# Altium schematic sheet Power Supplies.SchDoc: EEG Measurement Circuit
size A3; Date: 24/01/2025; DrawnBy: Giang Phan Truong; SheetNumber: 2; SheetTotal: 7
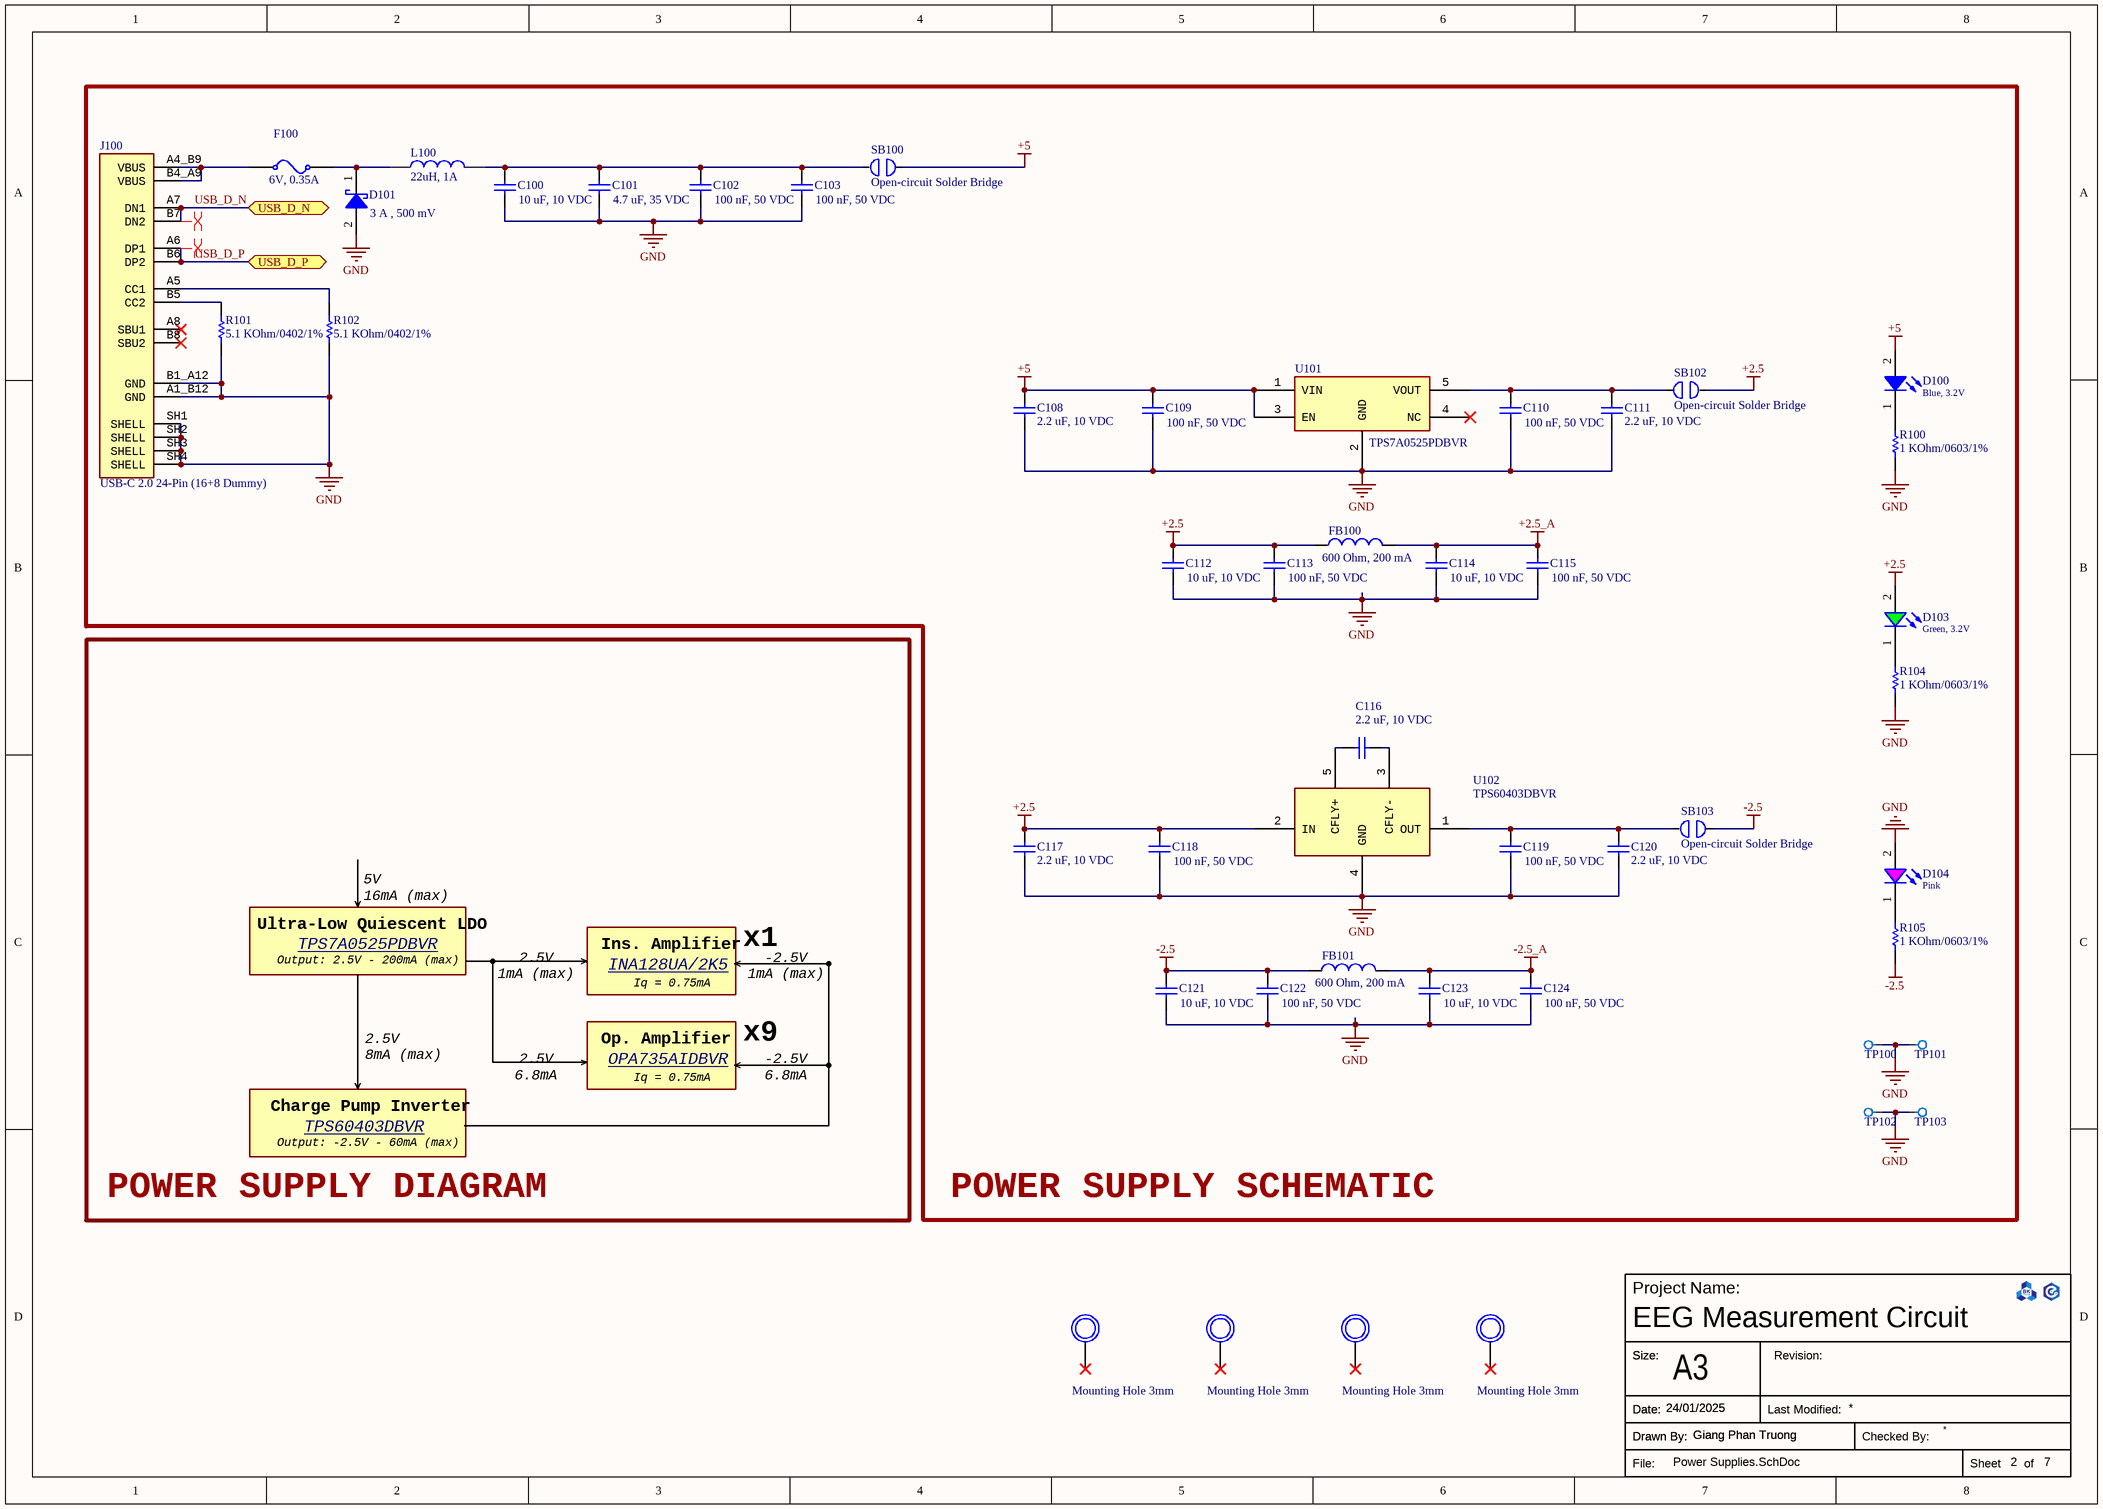
[diagram p0: Power Supplies.SchDoc]

## Parts
C100  10 uF, 10 VDC  [CAP_0603]
C101  4.7 uF, 35 VDC  [CAP_0603]
C102  100 nF, 50 VDC  [CAP_0603]
C103  100 nF, 50 VDC  [CAP_0603]
C108  2.2 uF, 10 VDC  [CAP_0603]
C109  100 nF, 50 VDC  [CAP_0603]
C110  100 nF, 50 VDC  [CAP_0603]
C111  2.2 uF, 10 VDC  [CAP_0603]
C112  10 uF, 10 VDC  [CAP_0603]
C113  100 nF, 50 VDC  [CAP_0603]
C114  10 uF, 10 VDC  [CAP_0603]
C115  100 nF, 50 VDC  [CAP_0603]
C116  2.2 uF, 10 VDC  [CAP_0603]
C117  2.2 uF, 10 VDC  [CAP_0603]
C118  100 nF, 50 VDC  [CAP_0603]
C119  100 nF, 50 VDC  [CAP_0603]
C120  2.2 uF, 10 VDC  [CAP_0603]
C121  10 uF, 10 VDC  [CAP_0603]
C122  100 nF, 50 VDC  [CAP_0603]
C123  10 uF, 10 VDC  [CAP_0603]
C124  100 nF, 50 VDC  [CAP_0603]
D100  Blue, 3.2V  [WL-SMCW_0603_H=0.7mm]
D101  3 A , 500 mV  [SMC (DO-214AB)]
D103  Green, 3.2V  [WL-SMCW_0603_H=0.7mm]
D104  Pink  [WL-SMCW_0603_H=0.7mm]
F100  6V, 0.35A  [Fuse_SMD_1206]
FB100  600 Ohm, 200 mA  [FER_0603]
FB101  600 Ohm, 200 mA  [FER_0603]
H100  Mounting Hole 3mm  [3mm with via]
H101  Mounting Hole 3mm  [3mm with via]
H102  Mounting Hole 3mm  [3mm with via]
H103  Mounting Hole 3mm  [3mm with via]
J100  value USB-C 2.0 24-Pin (16+8 Dummy)  [GCT_USB4105-GF-A]  (hidden comment: USB4105-GF-A)
L100  22uH, 1A  [Inductor_CDRH4D28]
R100  value 1 KOhm/0603/1%  [R0603]  (hidden comment: Resistor 1 KOhm 0603 1%)
R101  value 5.1 KOhm/0402/1%  [R0402]  (hidden comment: Resistor 5.1 KOhm 0402)
R102  value 5.1 KOhm/0402/1%  [R0402]  (hidden comment: Resistor 5.1 KOhm 0402)
R104  value 1 KOhm/0603/1%  [R0603]  (hidden comment: Resistor 1 KOhm 0603 1%)
R105  value 1 KOhm/0603/1%  [R0603]  (hidden comment: Resistor 1 KOhm 0603 1%)
SB100  Open-circuit Solder Bridge  [SolderBridgeOpen]
SB102  Open-circuit Solder Bridge  [SolderBridgeOpen]
SB103  Open-circuit Solder Bridge  [SolderBridgeOpen]
TP100  Testpoint_SMD  [TestPoint_Pad_3.0x3.0mm]  (value not drawn)
TP101  Testpoint_SMD  [TestPoint_Pad_3.0x3.0mm]  (value not drawn)
TP102  Testpoint_SMD  [TestPoint_Pad_3.0x3.0mm]  (value not drawn)
TP103  Testpoint_SMD  [TestPoint_Pad_3.0x3.0mm]  (value not drawn)
U101  TPS7A0525PDBVR  [DBV0005A_L]
U102  TPS60403DBVR  [SOT95P280X145-5N]

## Blocks framed on the sheet
POWER SUPPLY SCHEMATIC: C100-C103 C108-C124 D100 D101 D103 D104 F100 FB100 FB101 J100 L100 R100-R102 R104 R105 SB100 SB102 SB103 TP100-TP103 U101 U102

## Ports
USB_D_N (bidir, see Block Diagram[7B], Interface[5B]), USB_D_P (bidir, see Block Diagram[7B], Interface[5B])

## Nets
+2.5: C112.2 C113.2 C117.2 C118.2 D103.2(A) FB100.1 SB102.1 U102.2(IN)
+2.5_A: C114.2 C115.2 FB100.2
+5: C108.2 C109.2 D100.2(A) SB100.1 U101.1(VIN) U101.3(EN)
-2.5: C121.2 C122.2 FB101.1 R105.2 SB103.1
-2.5_A: C123.2 C124.2 FB101.2
GND: C100.1 C101.1 C102.1 C103.1 C108.1 C109.1 C110.1 C111.1 C112.1 C113.1 C114.1 C115.1 C117.1 C118.1 C119.1 C120.1 C121.1 C122.1 C123.1 C124.1 D101.2(A) D104.2(A) J100.A1_B12(GND) J100.B1_A12(GND) J100.SH1(SHELL) J100.SH2(SHELL) J100.SH3(SHELL) J100.SH4(SHELL) R100.2 R101.1 R102.1 R104.2 TP100.1 TP101.1 TP102.1 TP103.1 U101.2(GND) U102.4(GND)
USB_D_N: J100.A7(DN1) J100.B7(DN2) ; port USB_D_N
USB_D_P: J100.A6(DP1) J100.B6(DP2) ; port USB_D_P
NetC100_2: C100.2 C101.2 C102.2 C103.2 L100.2 SB100.2
NetC110_2: C110.2 C111.2 SB102.2 U101.5(VOUT)
NetC116_1: C116.1 U102.3(CFLY-)
NetC116_2: C116.2 U102.5(CFLY+)
NetC119_2: C119.2 C120.2 SB103.2 U102.1(OUT)
NetD100_1: D100.1(K) R100.1
NetD101_1: D101.1(K) F100.1 L100.1
NetD103_1: D103.1(K) R104.1
NetD104_1: D104.1(K) R105.1
NetF100_0: F100.0 J100.A4_B9(VBUS) J100.B4_A9(VBUS)
NetJ100_A5: J100.A5(CC1) R102.2
NetJ100_B5: J100.B5(CC2) R101.2

Not connected (* = marked no-connect by the designer): H100 0; H101 0; H102 0; H103 0; J100 A8(SBU1)* B8(SBU2)*; U101 4(NC)*

## Layout directives
differential pair: USB_D_N, USB_D_P

## Notes on the sheet
- 5V
  16mA (max)
- Ultra-Low Quiescent LDO
- Output: 2.5V - 200mA (max)
- TPS7A0525PDBVR <https://www.digikey.com/en/products/detail/texas-instruments/TPS7A0525PDBVR/9489224>
- 2.5V
  1mA (max)
- Ins. Amplifier
- INA128UA/2K5 <https://www.digikey.com/en/products/detail/texas-instruments/INA128UA-2K5/300998>
- Iq = 0.75mA
- x1
- -2.5V
  1mA (max)
- 2.5V
  8mA (max)
- Op. Amplifier
- x9
- Charge Pump Inverter
- 2.5V
  6.8mA (max)
- OPA735AIDBVR <https://www.digikey.com/en/products/detail/texas-instruments/OPA735AIDBVR/1572946>
- -2.5V
  6.8mA (max)
- Output: -2.5V - 60mA (max)
- TPS60403DBVR <https://www.digikey.com/en/products/detail/texas-instruments/TPS60403DBVR/1672064>
- POWER SUPPLY DIAGRAM
- Project Name:
- Size
- Size:
- A3
- Revision:
- Drawn By:
- Date:
- File:
- Last Modified:
- Checked By:
- Sheet
- of

## Library data of the parts
C100 C112 C114 C121 C123 = 0106031061010: CAP, size 0603, 10 uF, 10 VDC; Manufacture Name: Samsung Electro-Mechanics; Manufacture SN: CL10A106KP8NNWC; Capacitance: 10 uF; Tolerance: +/-10%; Voltage Rating DC: 10 VDC; ComponentLink2Description: Datasheet; ComponentLink2URL: https://www.mouser.vn/datasheet/2/585/MLCC-1837944.pdf; Operating Temperature: -55 to +125degC; Packaging: Tape and Reel; Mounting Technology: SMT; Size: 0603; Supplier 1 Name: Mouser; Supplier 1 SN: 187-CL10A106KP8NNWC; Supplier 1 URL: https://www.mouser.vn/ProductDetail/Samsung-Electro-Mechanics/CL10A106KP8NNWC?qs=xZ%2FP%252Ba9zWqZx8LSX23YqWA%3D%3D&utm_source=mouser-refine-download&utm_medium=file&utm_campaign=CL10A106KP8NNWC&utm_content=Samsung-Electro-Mechanics; Supplier 2 Name: Digi-Key; Supplier 2 SN: 1276-CL10A106KP8NNWCTR-ND; Supplier 2 URL: https://www.digikey.com/en/products/detail/samsung-electro-mechanics/cl10a106kp8nnwc/16572907; Supplier 3 Name: thegioiic; Supplier 3 SN: N/A; Supplier 3 URL: https://www.thegioiic.com/tu-gom-0603-10uf-25v; Value: 10 uF, 10 VDC; Buy: http://tme.vn/Product.aspx?id=1165#page=pro_info
C101 = 0106034751035: CAP, size 0603, 4.7 uF, 35 VDC; Manufacture Name: Samsung Electro-Mechanics; Manufacture SN: CL10A475KL8NRNC; Capacitance: 4.7 uF; Tolerance: +/-10%; Voltage Rating DC: 35 VDC; ComponentLink2Description: Datasheet; ComponentLink2URL: https://www.mouser.vn/datasheet/2/585/MLCC-1837944.pdf; Operating Temperature: -55 to +125degC; Packaging: Tape and Reel; Mounting Technology: SMT; Size: 0603; Supplier 1 Name: Mouser; Supplier 1 SN: 187-CL10A475KL8NRNC; Supplier 1 URL: https://www.mouser.vn/ProductDetail/Samsung-Electro-Mechanics/CL10A475KL8NRNC?qs=xZ%2FP%252Ba9zWqa0jfvJtp%252BUEg%3D%3D&utm_source=mouser-refine-download&utm_medium=file&utm_campaign=CL10A475KL8NRNC&utm_content=Samsung-Electro-Mechanics; Supplier 2 Name: Digi-Key; Supplier 2 SN: 1276-6794-2-ND; Supplier 2 URL: https://www.digikey.com/en/products/detail/samsung-electro-mechanics/cl10a475kl8nrnc/5961278; Supplier 3 Name: thegioiic; Supplier 3 SN: N/A; Supplier 3 URL: N/A; Value: 4.7 uF, 35 VDC; ComponentLink3Description: Buy; ComponentLink3URL: http://www.tme.vn/Product.aspx?id=1163#page=pro_info
C102 C103 C109 C110 C113 C115 C118 C119 C122 C124 = 0106031041050: CAP, size 0603, 100 nF, 50 VDC; Manufacture Name: TDK; Manufacture SN: CGA3E3X8R1H104K080AE; Capacitance: 100 nF; Tolerance: +/-10%; Voltage Rating DC: 50 VDC; ComponentLink2Description: Datasheet; ComponentLink2URL: https://product.tdk.com/system/files/dam/doc/product/capacitor/ceramic/mlcc/catalog/mlcc_automotive_soft_en.pdf?ref_disty=mouser; Operating Temperature: -55 to +125degC; Packaging: Tape and Reel; Mounting Technology: SMT; Size: 0603; Supplier 1 Name: Mouser; Supplier 1 SN: 810-CGA3E3X8R1H104KA; Supplier 1 URL: https://www.mouser.com/ProductDetail/TDK/CGA3E3X8R1H104K080AE?qs=nQSIdc08i%252Bd8g3IRRgU2bw%3D%3D&utm_source=mouser-refine-download&utm_medium=file&utm_campaign=CGA3E3X8R1H104K080AE&utm_content=TDK; Supplier 2 Name: Digi-Key; Supplier 2 SN: 445-173697-2-ND; Supplier 2 URL: https://www.digikey.com/en/products/detail/tdk-corporation/cga3e3x8r1h104k080ae/5809262; Supplier 3 Name: thegioiic; Supplier 3 SN: N/A; Supplier 3 URL: N/A; Value: 100 nF, 50 VDC
  C102 C103: ComponentLink3Description: Buy; ComponentLink3URL: http://www.tme.vn/Product.aspx?id=739#page=pro_info
C108 C111 C116 C117 C120 = 0106032251010: CAP, size 0603, 2.2 uF, 10 VDC; Manufacture Name: Samsung Electro-Mechanics; Manufacture SN: CL10A225KP8NNWC; Capacitance: 2.2 uF; Tolerance: +/-10%; Voltage Rating DC: 10 VDC; ComponentLink2Description: Datasheet; ComponentLink2URL: https://www.mouser.vn/datasheet/2/585/Samsung_MLCC_1837944-1929650.pdf; Operating Temperature: -55 to +125degC; Packaging: Tape and Reel; Mounting Technology: SMT; Size: 0603; Supplier 1 Name: Mouser; Supplier 1 SN: 187-CL10A225KP8NNWC; Supplier 1 URL: https://www.mouser.vn/ProductDetail/Samsung-Electro-Mechanics/CL10A225KP8NNWC?qs=f6khj2Jg0Fj5oIVDjMV6rg%3D%3D&utm_source=mouser-refine-download&utm_medium=file&utm_campaign=CL10A225KP8NNWC&utm_content=Samsung-Electro-Mechanics; Supplier 2 Name: Digi-Key; Supplier 2 SN: 1276-CL10A225KP8NNWCTR-ND; Supplier 2 URL: https://www.digikey.com/en/products/detail/samsung-electro-mechanics/cl10a225kp8nnwc/16572766; Supplier 3 Name: thegioiic; Supplier 3 SN: N/A; Supplier 3 URL: N/A; Value: 2.2 uF, 10 VDC
D100 = 160603BlueBlur: WL-SMCW SMT Mono-color Chip LED Blur, size 0603, Blue, 3.2V, 140deg; Color: Blue; Size: 0603; Type: Blur; ComponentLink1Description: Datasheet link; ComponentLink1URL: N/A; ComponentLink2Description: Supplier 1 URL; ComponentLink2URL: https://www.mouser.vn/ProductDetail/ams-OSRAM/LB-Q39E-L2OO-35-1?qs=74fRo9GAWsz%2FeNvglIOl1w%3D%3D; ComponentLink3Description: Supplier 2 URL; ComponentLink3URL: https://www.digikey.com/en/products/detail/ams-osram-usa-inc/LB-Q39E-N1OO-35-1/2176321; ComponentLink4Description: Supplier 3 URL; ComponentLink4URL: N/A; Supplier 1 Name: Mouser; Supplier 1 SN: 720-LBQ39EL2N2351; Supplier 1 URL: https://www.mouser.vn/ProductDetail/ams-OSRAM/LB-Q39E-L2OO-35-1?qs=74fRo9GAWsz%2FeNvglIOl1w%3D%3D; Supplier 2 Name: Digi-Key; Supplier 2 SN: 475-LBQ39E-N1OO-35-1TR-ND; Supplier 2 URL: https://www.digikey.com/en/products/detail/ams-osram-usa-inc/LB-Q39E-N1OO-35-1/2176321; Supplier 3 Name: ICDayRoi; Supplier 3 SN: N/A; Supplier 3 URL: N/A; Value: Blue, 3.2V; ComponentLink5Description: Buy; ComponentLink5URL: https://www.thegioiic.com/led-xanh-duong-0603-dan-smd-trong-suot-harvatek
D101 = SS34: Schottky Diodes & Rectifiers 3.0 Amp 40 Volt; Manufacturer: Vishay Semiconductors; Manufacturer Part Number: SS34-E3/57T; Forward Current: 3 A; Forward Voltage: 500 mV; Max Surge Current: 100 A; Peak Reverse Voltage: 40 V; Reverse Current: 500 uA; Type: Schottky; Supplier 1 URL: https://www.mouser.vn/ProductDetail/Vishay-General-Semiconductor/SS34-E3-57T?qs=x2jpVgRnAtMC3f38kYWnRw%3D%3D; Supplier 2 URL: https://www.digikey.com/en/products/detail/vishay-general-semiconductor-diodes-division/ss34-e3-57t/1091554; Supplier 3 URL: https://www.thegioiic.com/ss34-sma-diode-schottky-3a; Value: 3 A , 500 mV; Maximum Diode Capacitance: N/A; Power Dissipation: N/A; Recovery Time: N/A; Supplier 1: Mouser; Supplier 1 Part Number: 625-SS34-E3; Supplier 2: Digi-Key; Supplier 2 Part Number: SS34-E3/57TGITR-ND; Supplier 3: thegioiic; Supplier 3 Part Number: SS34; Mount: SMD/SMT; Operating Temperature Max: + 85 C; Operating Temperature Min: - 40 C; Package / Case: SMC (DO-214AB); Packaging: Tape and Reel; ComponentLink1Description: Datasheet; ComponentLink1URL: https://www.vishay.com/doc?88751; LCSC Part #: C3008890
D103 = 160603GreenBlur: WL-SMCW SMT Mono-color Chip LED Blur, size 0603, Green, 3.2V, 140deg; Color: Green; Size: 0603; Type: Blur; ComponentLink1Description: Datasheet link; ComponentLink1URL: N/A; ComponentLink2Description: Supplier 1 URL; ComponentLink2URL: https://www.mouser.vn/ProductDetail/ROHM-Semiconductor/SMLD12EN1WT86?qs=qSfuJ%252Bfl%2Fd4fR%252B9yZydIwg%3D%3D; ComponentLink3Description: Supplier 2 URL; ComponentLink3URL: https://www.digikey.com/en/products/detail/rohm-semiconductor/SML-D12M8WT86/1641797; ComponentLink4Description: Supplier 3 URL; ComponentLink4URL: N/A; Supplier 1 Name: Mouser; Supplier 1 SN: 755-SMLD12EN1WT86; Supplier 1 URL: https://www.mouser.vn/ProductDetail/ROHM-Semiconductor/SMLD12EN1WT86?qs=qSfuJ%252Bfl%2Fd4fR%252B9yZydIwg%3D%3D; Supplier 2 Name: Digi-Key; Supplier 2 SN: 511-1578-2-ND; Supplier 2 URL: https://www.digikey.com/en/products/detail/rohm-semiconductor/SML-D12M8WT86/1641797; Supplier 3 Name: ICDayRoi; Supplier 3 SN: N/A; Supplier 3 URL: N/A; Value: Green, 3.2V; ComponentLink5Description: Buy; ComponentLink5URL: https://www.thegioiic.com/led-xanh-la-0603-dan-smd-trong-suot
D104 = 160603PinkBlur: WL-SMCW SMT Mono-color Chip LED Blur, size 0603, Pink; Color: Pink; Size: 0603; Type: Blur; ComponentLink1Description: Datasheet link; ComponentLink1URL: N/A; ComponentLink2Description: Supplier 1 URL; ComponentLink2URL: N/A; ComponentLink3Description: Supplier 2 URL; ComponentLink3URL: https://www.digikey.com/en/products/detail/rohm-semiconductor/SMLD12HBC7W1/3587026; ComponentLink4Description: Supplier 3 URL; ComponentLink4URL: N/A; Supplier 1 Name: Mouser; Supplier 1 SN: N/A; Supplier 1 URL: N/A; Supplier 2 Name: Digi-Key; Supplier 2 SN: 846-1108-2-ND; Supplier 2 URL: https://www.digikey.com/en/products/detail/rohm-semiconductor/SMLD12HBC7W1/3587026; Supplier 3 Name: ICDayRoi; Supplier 3 SN: N/A; Supplier 3 URL: N/A; Value: Pink; ComponentLink5Description: Buy; ComponentLink5URL: https://www.thegioiic.com/led-hong-0603-dan-smd-trong-suot
F100 = 061206035006: Resettable Fuse, Size 1206, 6V, 0.35A; Manufacturer: Bourns; Threshold Current: 100A; Trip Current: 0.75A; Threshold Voltage: 6V; Hold Current: 0.35A; Size: 1206; Mounting Technology: SMT/SMD; ComponentLink1Description: Datasheet link; ComponentLink1URL: https://www.bourns.com/docs/Product-Datasheets/mfnsmf.pdf; ComponentLink2Description: Supplier 1 URL; ComponentLink2URL: https://www.mouser.vn/ProductDetail/Bourns/MF-NSMF035-2?qs=3eVyCPG4fwnHDrvs%2FGppSw%3D%3D; ComponentLink3Description: Supplier 2 URL; ComponentLink3URL: https://www.digikey.com/en/products/detail/bourns-inc/MF-NSMF035-2/1232784?s=N4IgTCBcDaILIDEC0A5AyogDAZgKxIgF0BfIA; ComponentLink4Description: Supplier 3 URL; ComponentLink4URL: https://www.thegioiic.com/mf-nsmf035-2-cau-chi-tu-phuc-hoi-1206-6v-0-35a; Supplier 1 Name: Mouser; Supplier 1 SN: 652-MF-NSMF035-2; Supplier 1 URL: https://www.mouser.vn/ProductDetail/Bourns/MF-NSMF035-2?qs=3eVyCPG4fwnHDrvs%2FGppSw%3D%3D; Supplier 2 Name: Digi-Key; Supplier 2 SN: MF-NSMF035-2TR-ND; Supplier 2 URL: https://www.mouser.vn/ProductDetail/Bourns/MF-NSMF035-2?qs=3eVyCPG4fwnHDrvs%2FGppSw%3D%3D; Supplier 3 Name: thegioiic; Supplier 3 SN: MF-NSMF035-2; Supplier 3 URL: https://www.thegioiic.com/mf-nsmf035-2-cau-chi-tu-phuc-hoi-1206-6v-0-35a; Value: 6V, 0.35A
FB100 FB101 = 03060360120125: Ferrite, 0603, 600 Ohms, 200 mA; Manufacture Name: Wurth Elektronik; Manufacture SN: 74279265; Tolerance: +/-25%; Maximum DC Current: 200 mA; Maximum DC Resistance: 450 mOhms; Test Frequency: 100 MHz; ComponentLink2Description: Datasheet; ComponentLink2URL: https://www.we-online.com/catalog/datasheet/74279265.pdf; Mounting Technology: SMT; Operating Temperature: -55 to +125degC; Packaging: Tape and Reel; Size: 0603; Supplier 1 SN: 710-74279265; Supplier 1 URL: https://www.mouser.com/ProductDetail/Wurth-Elektronik/74279265?qs=sGAEpiMZZMt1hubY80%2Fs8M60rIzA20dglmJIomIYNv0%3D&utm_source=mouser-refine-download&utm_medium=file&utm_campaign=74279265&utm_content=Wurth-Elektronik; Supplier 2 SN: N/A; Supplier 2 URL: N/A; Supplier 3 SN: N/A; Supplier 3 URL: N/A; Supplier 1 Name: Mouser; Supplier 2 Name: Digi-Key; Supplier 3 Name: thegioiic; Impedance: 600 Ohms; Value: 600 Ohm, 200 mA; Buy: *
J100 = USB4105-GF-A: USB-C (USB TYPE-C) USB 2.0 Receptacle Connector 24 (16+8 Dummy) Position Surface Mount, Right Angle; Through Hole; MF: {'manufacturer': u'GCT'}; Package: None; Price: None; MP: USB4105-GF-A; Availability: Unavailable; ComponentLink1Description: Buy; ComponentLink1URL: https://www.thegioiic.com/cong-usb-cai-3-1-type-c-16-chan-thang-dan-smd
L100 = IND_22uH_4D28: 22uH 20% 1A SMD Power Inductor 4.8x4.8x2.8 mm; Supply Name: tme; Supply Part Number: 22uH 20% 1A SMD Power Inductor 4.8x4.8x2.8 mm; Supply URL: http://www.tme.vn/Product.aspx?id=1639#page=pro_info; Value: 22uH, 1A; ComponentLink1Description: Buy; ComponentLink1URL: http://tme.vn/Product.aspx?id=1639#page=pro_info
R100 R104 R105 = Resistor 1 KOhm 0603 1%: Code 102, 1/10W; ComponentLink1Description: Buy; ComponentLink1URL: https://www.thegioiic.com/dien-tro-1-kohm-0603-1
R101 R102 = Resistor 5.1 KOhm 0402: RC0402FR-135K1L; ComponentLink1Description: Buy; ComponentLink1URL: https://www.digikey.com/en/products/detail/yageo/RC0402FR-135K1L/14286364
U101 = TPS7A0525PDBVR: Linear Voltage Regulator IC Positive Fixed 1 Output 200mA SOT-23-5; Mfr_Name: Texas Instruments; TYPE: TYPE; RefDes: RefDes; ComponentLink1Description: Buy; ComponentLink1URL: https://www.digikey.com/en/products/detail/texas-instruments/TPS7A0525PDBVR/9489224; Value: TPS7A0525PDBVR
U102 = TPS60403DBVR: 60mA Charge Pump Voltage Inverter with Fixed 250kHz Operation; MF: Texas Instruments; Mouser-Purchase-URL: https://snapeda.com/shop?store=Mouser&id=1101412; Availability: Unavailable; Price: None; Package: SOT-23-5 Texas Instruments; DigiKey-Purchase-URL: https://snapeda.com/shop?store=DigiKey&id=1101412; MP: TPS60403DBVR; SnapEDA_Link: https://www.snapeda.com/parts/TPS60403DBVR/Texas%20Instruments/view-part/1101412/?ref=snap; Arrow_Electronics-Purchase-URL: https://snapeda.com/shop?store=Arrow+Electronics&id=1101412; Texas_Instruments-Purchase-URL: https://snapeda.com/shop?store=Texas+Instruments&id=1101412; ComponentLink1Description: Buy; ComponentLink1URL: https://www.digikey.com/en/products/detail/texas-instruments/TPS60403DBVR/1672064; Value: TPS60403DBVR
TP100-TP103 = Testpoint_SMD: Datasheet: *; Supply Name: *; Supply Part Number: *; Supply URL: *